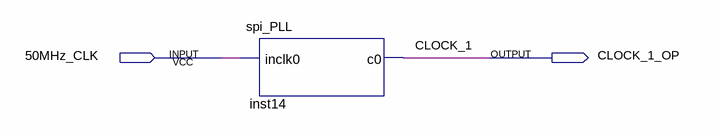
[diagram p0: schematic sheet]
// Quartus schematic top_level.bdf as structural Verilog: 1 symbols, 2 pins
module top_level (
  input  \50MHz_CLK ,
  output CLOCK_1_OP
);

  spi_PLL inst14 (.inclk0(\50MHz_CLK ), .c0(CLOCK_1_OP));

  // Other names for the same wires on the sheet: CLOCK_1 = CLOCK_1_OP
endmodule
